# Altium schematic sheet Main.SchDoc
size 152 x 101 mm
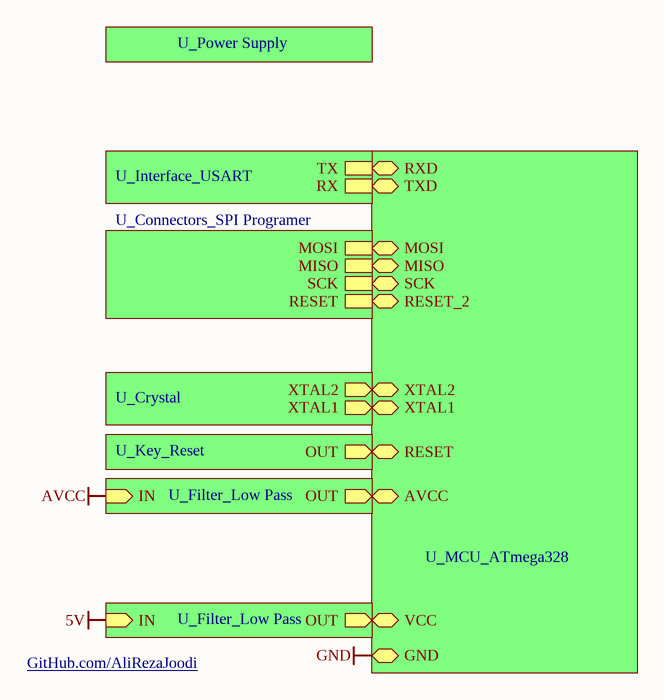
[diagram p0: Main.SchDoc]

## Sub-sheets
U_Connectors_SPI Programer = Connectors_SPI Programer.SchDoc: RESET, SCK, MISO, MOSI
U_Crystal = Crystal.SchDoc: XTAL2 (out), XTAL1 (out)
U_Filter_Low Pass = Filter_Low Pass.SchDoc: IN (in), OUT (out)
U_Filter_Low Pass = Filter_Low Pass.SchDoc: IN (in), OUT (out)
U_Interface_USART = Interface_USART.SchDoc: RX, TX
U_Key_Reset = Key_Reset.SchDoc: OUT (out)
U_MCU_ATmega328 = MCU_ATmega328.SchDoc: VCC, AVCC, RESET, XTAL2, XTAL1, MOSI, MISO, SCK, RESET_2, TXD, RXD, GND
U_Power Supply = Power Supply.SchDoc: no entries

## Nets
5V: sheet U_Filter_Low Pass/IN
AVCC: sheet U_Filter_Low Pass/IN
GND: sheet U_MCU_ATmega328/GND
(unnamed): sheet U_MCU_ATmega328/VCC, sheet U_Filter_Low Pass/OUT
(unnamed): sheet U_MCU_ATmega328/AVCC, sheet U_Filter_Low Pass/OUT
(unnamed): sheet U_MCU_ATmega328/RESET, sheet U_Key_Reset/OUT
(unnamed): sheet U_MCU_ATmega328/XTAL2, sheet U_Crystal/XTAL2
(unnamed): sheet U_MCU_ATmega328/XTAL1, sheet U_Crystal/XTAL1
(unnamed): sheet U_MCU_ATmega328/MOSI, sheet U_Connectors_SPI Programer/MOSI
(unnamed): sheet U_MCU_ATmega328/MISO, sheet U_Connectors_SPI Programer/MISO
(unnamed): sheet U_MCU_ATmega328/SCK, sheet U_Connectors_SPI Programer/SCK
(unnamed): sheet U_MCU_ATmega328/RESET_2, sheet U_Connectors_SPI Programer/RESET
(unnamed): sheet U_MCU_ATmega328/TXD, sheet U_Interface_USART/RX
(unnamed): sheet U_MCU_ATmega328/RXD, sheet U_Interface_USART/TX

## Notes on the sheet
- GitHub.com/AliRezaJoodi